# EAGLE design Platypus_v1_0_Proto_v16_0 (EAGLE 7.5.0)
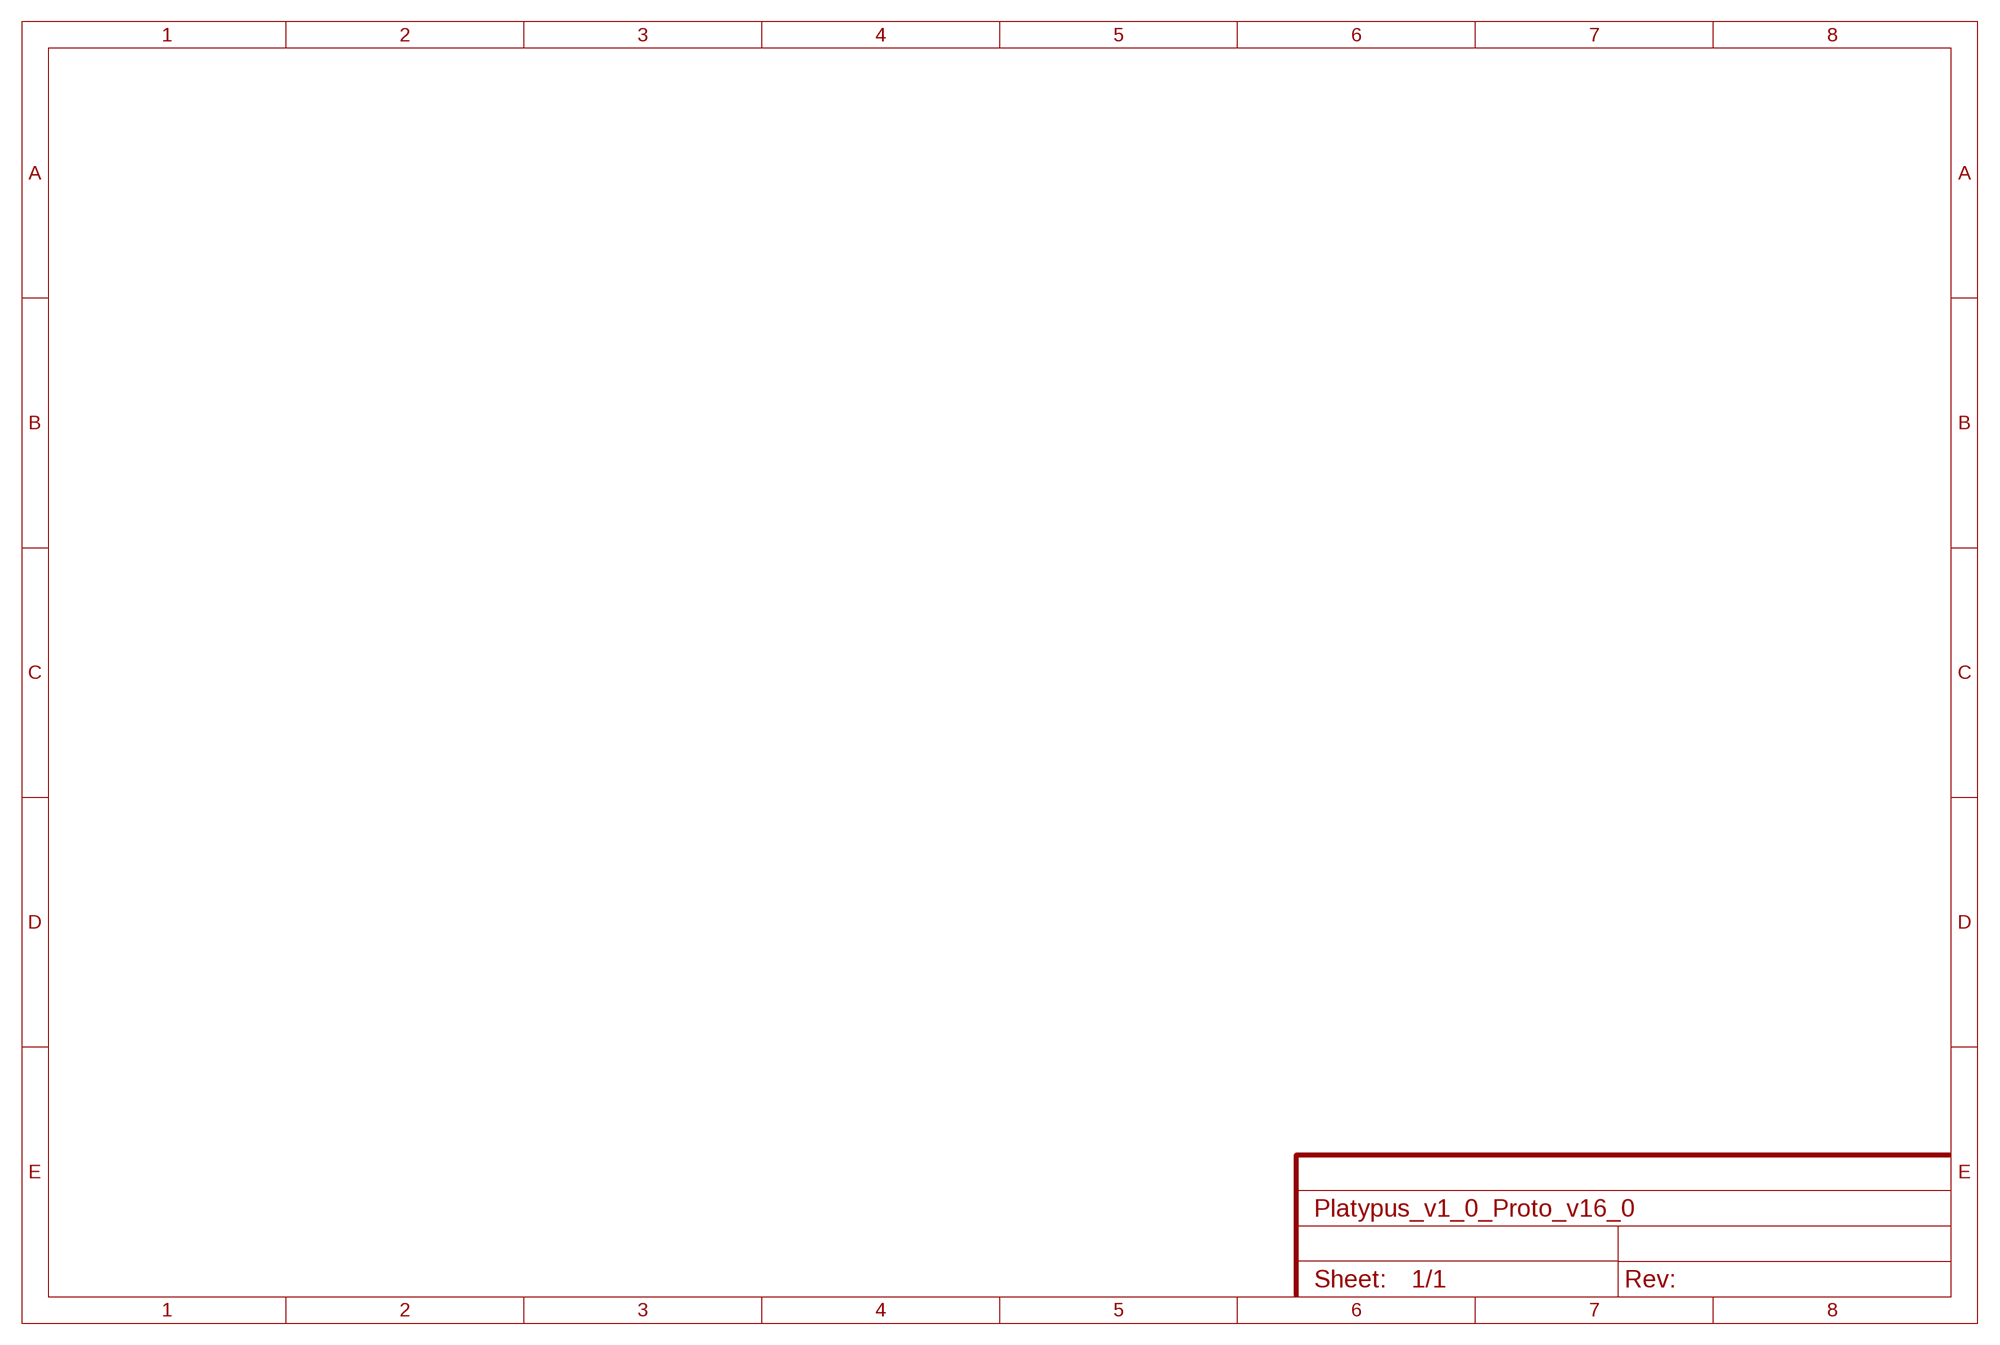
[diagram p0: schematic, sheet 1, part 1 of 2]
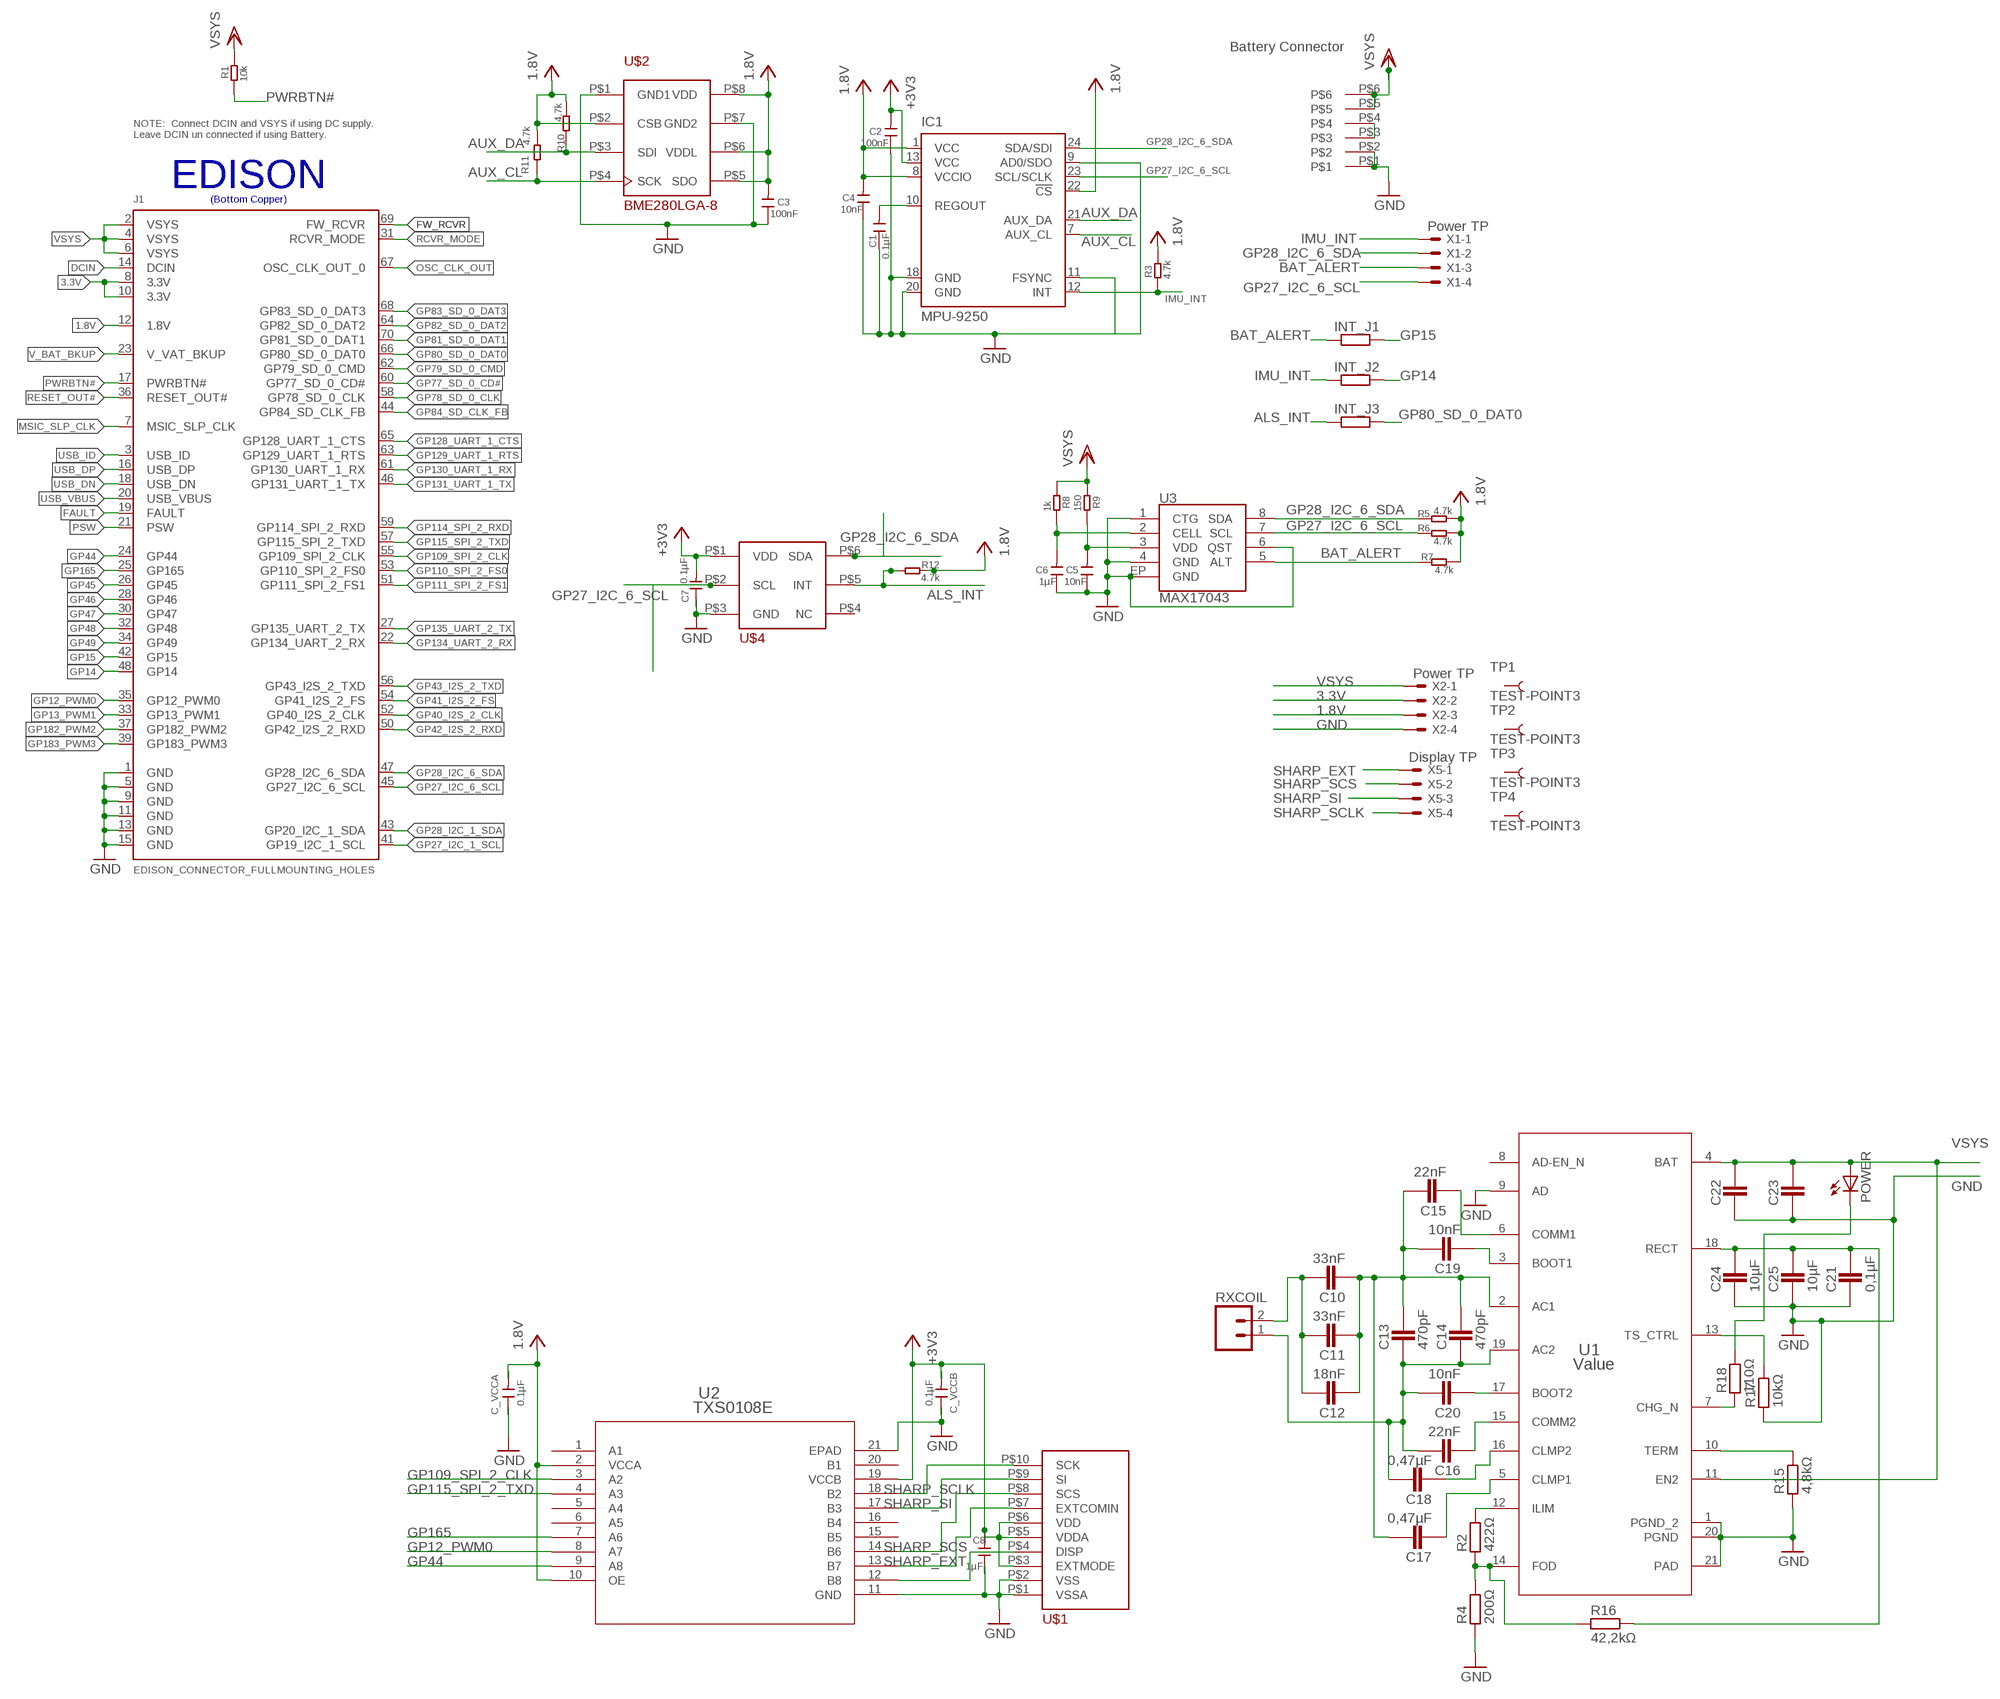
[diagram p1: schematic, sheet 1, part 2 of 2]

## Parts
C1  0.1µF  C-0603  [C0603]
C2  100nF  C-0603  [C0603]
C3  100nF  C-0603  [C0603]
C4  10nF  C-0603  [C0603]
C5  10nF  C-0603  [C0603]
C6  1µF  C-0603  [C0603]
C7  0.1µF  C-0603  [C0603]
C8  1µF  C-0603  [C0603]
C10  33nF  CAPACITOR_0402  [CAPC1005X60N]
C11  33nF  CAPACITOR_0402  [CAPC1005X60N]
C12  18nF  CAPACITOR_0402  [CAPC1005X60N]
C13  470pF  CAPACITOR_0402  [CAPC1005X60N]
C14  470pF  CAPACITOR_0402  [CAPC1005X60N]
C15  22nF  CAPACITOR_0402  [CAPC1005X60N]
C16  22nF  CAPACITOR_0402  [CAPC1005X60N]
C17  0,47µF  CAPACITOR_0402  [CAPC1005X60N]
C18  0,47µF  CAPACITOR_0402  [CAPC1005X60N]
C19  10nF  CAPACITOR_0402  [CAPC1005X60N]
C20  10nF  CAPACITOR_0402  [CAPC1005X60N]
C21  0,1µF  CAPACITOR_0402  [CAPC1005X60N]
C22  CAPACITOR_0402  [CAPC1005X60N]
C23  CAPACITOR_0402  [CAPC1005X60N]
C24  10µF  CAPACITOR_0603  [CAPC1608X92N]
C25  10µF  CAPACITOR_0603  [CAPC1608X92N]
C_VCCA  0.1µF  C-0603  [C0603]
C_VCCB  0.1µF  C-0603  [C0603]
IC1  MPU-9250  [QFN24-SMALL]
INT_J1  R-EU_R0201  [R0201]
INT_J2  R-EU_R0201  [R0201]
INT_J3  R-EU_R0201  [R0201]
J1  EDISON_CONNECTOR_FULLMOUNTING_HOLES  [EDISON_DAUGHTER]
POWER  LEDSML0603  [SML0603]
R1  10k  R-0603  [R0603]
R2  422Ω  RESISTOR_0402  [RESC1005X40AN]
R3  4.7k  R-0603  [R0603]
R4  200Ω  RESISTOR_0402  [RESC1005X40AN]
R5  4.7k  R-0603  [R0603]
R6  4.7k  R-0603  [R0603]
R7  4.7k  R-0603  [R0603]
R8  1k  R-0603  [R0603]
R9  150  R-0603  [R0603]
R10  4.7k  R-0603  [R0603]
R11  4.7k  R-0603  [R0603]
R12  4.7k  R-0603  [R0603]
R15  4,8kΩ  RESISTOR_0402  [RESC1005X40AN]
R16  42,2kΩ  RESISTOR_0402  [RESC1005X40AN]
R17  10kΩ  RESISTOR_0402  [RESC1005X40AN]
R18  110Ω  RESISTOR_0402  [RESC1005X40AN]
RXCOIL  M02LOCK  [1X02_LOCK]
TP1  TEST-POINT3  [PAD.03X.03]
TP2  TEST-POINT3  [PAD.03X.03]
TP3  TEST-POINT3  [PAD.03X.03]
TP4  TEST-POINT3  [PAD.03X.03]
U1  Value  BQ51050BRHLR  [RHL0020A]
U2  TXS0108E  TXS0108E_RGY_20  [RGY20_3P05X2P05]
U3  MAX17043  MAX1704X  [TDFN-8]
U$1  FH34SRJ-10S-0.5SH(50)FRC-10PIN-0.5MM  [FRC-10PIN-0.5MM]
U$2  BME280LGA-8  [LGA-8]
U$3  HIROSE_BAT_CON  [0.5MM-PITCH,6-PIN]
U$4  TSL25723FNFN-6PIN  [FN-6PIN]
X1  Power TP  53047-04  [53047-04]
X2  Power TP  53047-04  [53047-04]
X5  Display TP  53047-04  [53047-04]

## Nets
1.8V: C3.2 C4.2 C_VCCA.2 IC1.1(VCC) IC1.8(VCCIO) IC1.22(!CS) J1.12(1.8V) R3.2 R5.2 R6.2 R7.1 R10.2 R11.2 R12.2 U2.2(VCCA) U2.10(OE) U$2.P$2(CSB) U$2.P$5(SDO) U$2.P$6(VDDL) U$2.P$8(VDD) X2.3
3.3V: C2.2 C7.2 IC1.13(VCC) J1.8(3.3V) J1.10(3.3V) U$4.P$1(VDD) X2.2 ; supply symbol labelled +3V3
+3V3: C8.2 C_VCCB.2 U2.19(VCCB) U$1.P$3(EXTMODE) U$1.P$5(VDDA) U$1.P$6(VDD)
ALS_INT: INT_J3.1 R12.1 U$4.P$5(INT)
AUX_CL: IC1.7(AUX_CL) R11.1 U$2.P$4(SCK)
AUX_DA: IC1.21(AUX_DA) R10.1 U$2.P$3(SDI)
BAT_ALERT: INT_J1.1 R7.2 U3.5(ALT) X1.3
DCIN: J1.14(DCIN)
FAULT: J1.19(FAULT)
FW_RCVR: J1.69(FW_RCVR)
GND: C1.1 C2.1 C3.1 C4.1 C5.1 C6.1 C7.1 C21.1 C22.1 C23.1 C24.1 C25.1 C_VCCA.1 C_VCCB.1 IC1.9(AD0/SDO) IC1.11(FSYNC) IC1.18(GND) IC1.20(GND) J1.1(GND) J1.5(GND) J1.9(GND) J1.11(GND) J1.13(GND) J1.15(GND) R4.1 R15.1 R17.1 U1.1(PGND_2) U1.9(AD) U1.20(PGND) U1.21(PAD) U2.11(GND) U2.21(EPAD) U3.1(CTG) U3.4(GND) U3.6(QST) U3.EP(GND) U$1.P$1(VSSA) U$1.P$2(VSS) U$2.P$1(GND1) U$2.P$7(GND2) U$3.P$1 U$3.P$2 U$4.P$3(GND) X2.4
GP12_PWM0: J1.35(GP12_PWM0) U2.8(A7)
GP13_PWM1: J1.33(GP13_PWM1)
GP14: INT_J2.2 J1.48(GP14)
GP15: INT_J1.2 J1.42(GP15)
GP27_I2C_1_SCL: J1.41(GP19_I2C_1_SCL)
GP27_I2C_6_SCL: IC1.23(SCL/SCLK) J1.45(GP27_I2C_6_SCL) R6.1 U3.7(SCL) U$4.P$2(SCL) X1.4
GP28_I2C_1_SDA: J1.43(GP20_I2C_1_SDA)
GP28_I2C_6_SDA: IC1.24(SDA/SDI) J1.47(GP28_I2C_6_SDA) R5.1 U3.8(SDA) U$4.P$6(SDA) X1.2
GP40_I2S_2_CLK: J1.52(GP40_I2S_2_CLK)
GP41_I2S_2_FS: J1.54(GP41_I2S_2_FS)
GP42_I2S_2_RXD: J1.50(GP42_I2S_2_RXD)
GP43_I2S_2_TXD: J1.56(GP43_I2S_2_TXD)
GP44: J1.24(GP44) U2.9(A8)
GP45: J1.26(GP45)
GP46: J1.28(GP46)
GP47: J1.30(GP47)
GP48: J1.32(GP48)
GP49: J1.34(GP49)
GP77_SD_0_CD#: J1.60(GP77_SD_0_CD#)
GP78_SD_0_CLK: J1.58(GP78_SD_0_CLK)
GP79_SD_0_CMD: J1.62(GP79_SD_0_CMD)
GP80_SD_0_DAT0: INT_J3.2 J1.66(GP80_SD_0_DAT0)
GP81_SD_0_DAT1: J1.70(GP81_SD_0_DAT1)
GP82_SD_0_DAT2: J1.64(GP82_SD_0_DAT2)
GP83_SD_0_DAT3: J1.68(GP83_SD_0_DAT3)
GP84_SD_CLK_FB: J1.44(GP84_SD_CLK_FB)
GP109_SPI_2_CLK: J1.55(GP109_SPI_2_CLK) U2.3(A2)
GP110_SPI_2_FS0: J1.53(GP110_SPI_2_FS0)
GP111_SPI_2_FS1: J1.51(GP111_SPI_2_FS1)
GP114_SPI_2_RXD: J1.59(GP114_SPI_2_RXD)
GP115_SPI_2_TXD: J1.57(GP115_SPI_2_TXD) U2.4(A3)
GP128_UART_1_CTS: J1.65(GP128_UART_1_CTS)
GP129_UART_1_RTS: J1.63(GP129_UART_1_RTS)
GP130_UART_1_RX: J1.61(GP130_UART_1_RX)
GP131_UART_1_TX: J1.46(GP131_UART_1_TX)
GP134_UART_2_RX: J1.22(GP134_UART_2_RX)
GP135_UART_2_TX: J1.27(GP135_UART_2_TX)
GP165: J1.25(GP165) U2.7(A6)
GP182_PWM2: J1.37(GP182_PWM2)
GP183_PWM3: J1.39(GP183_PWM3)
IMU_INT: IC1.12(INT) INT_J2.1 R3.1 X1.1
MSIC_SLP_CLK: J1.7(MSIC_SLP_CLK)
N$2: U2.12(B8) U$1.P$4(DISP)
N$5: C1.2 IC1.10(REGOUT)
N$6: C6.2 R8.1 U3.2(CELL)
N$9: U$3.P$3 U$3.P$4
N$11: C10.2 C11.2 C12.2 RXCOIL.2
N$13: C5.2 R9.1 U3.3(VDD)
N$14: C10.1 C11.1 C12.1 C13.2 C14.2 C15.2 C17.2 C19.2 U1.2(AC1)
N$15: C13.1 C14.1 C16.2 C18.2 C20.2 RXCOIL.1 U1.19(AC2)
N$16: C15.1 U1.6(COMM1)
N$17: C16.1 U1.15(COMM2)
N$18: C17.1 U1.5(CLMP1)
N$19: C18.1 U1.16(CLMP2)
N$20: C19.1 U1.3(BOOT1)
N$21: C20.1 U1.17(BOOT2)
N$22: C21.2 C24.2 C25.2 R16.2 U1.18(RECT)
N$25: R2.2 U1.12(ILIM)
N$26: R2.1 R4.2 R16.1 U1.14(FOD)
N$27: R15.2 U1.10(TERM)
N$28: R17.2 U1.13(TS_CTRL)
N$29: POWER.C R18.2
N$30: R18.1 U1.7(CHG_N)
OSC_CLK_OUT: J1.67(OSC_CLK_OUT_0)
PSW: J1.21(PSW)
PWRBTN#: J1.17(PWRBTN#) R1.1
RCVR_MODE: J1.31(RCVR_MODE)
RESET_OUT#: J1.36(RESET_OUT#)
SHARP_EXT: U2.13(B7) U$1.P$7(EXTCOMIN) X5.1
SHARP_SCLK: U2.18(B2) U$1.P$10(SCK) X5.4
SHARP_SCS: U2.14(B6) U$1.P$8(SCS) X5.2
SHARP_SI: U2.17(B3) U$1.P$9(SI) X5.3
USB_DN: J1.18(USB_DN)
USB_DP: J1.16(USB_DP)
USB_ID: J1.3(USB_ID)
USB_VBUS: J1.20(USB_VBUS)
V_BAT_BKUP: J1.23(V_VAT_BKUP)
VSYS: C22.2 C23.2 J1.2(VSYS) J1.4(VSYS) J1.6(VSYS) POWER.A R1.2 R8.2 R9.2 U1.4(BAT) U1.11(EN2) U$3.P$5 U$3.P$6 X2.1
Unconnected: C8.1 TP1.P$1 TP2.P$1 TP3.P$1 TP4.P$1 U1.8(AD-EN_N) U2.1(A1) U2.5(A4) U2.6(A5) U2.15(B5) U2.16(B4) U2.20(B1) U$4.P$4(NC)

## Notes on the sheet
- Battery Connector
- NOTE:  Connect DCIN and VSYS if using DC supply.
  Leave DCIN un connected if using Battery.
- EDISON
- (Bottom Copper)

## Library data of the parts
C1-C8 C_VCCA C_VCCB = Discrete:C*: Ceramic Capacitors
C10-C25 = ipc-7351-capacitor:CAPACITOR_
IC1 = invensense:MPU-9250: 9-axis MotionTracking device communicate with I2C/SPI Source: http://www.invensense.com/mems/gyro/documents/PS-MPU-9250A-01.pdf
INT_J1-INT_J3 = resistor:R-EU_: RESISTOR, European symbol
J1 = Edison:EDISON_CONNECTOR_FULL
POWER = led:LED: LED OSRAM: - CHIPLED LG R971, LG N971, LY N971, LG Q971, LY Q971, LO R971, LY R971 LH N974, LH R974 LS Q976, LO Q976, LY Q976 LO Q996 - Hyper CHIPLED LW Q18S LB Q993, LB Q99A, LB R99A - SideLED LS A670, LO A670, LY A670, LG A670, LP A670 LB A673, LV A673, LT A673, LW A673 LH A674 LY A675 LS A676, LA A676, LO A676, LY A676, LW A676 LS A679, LY A679, LG A679 - Hyper Micro SIDELED® LS Y876, LA Y876, LO Y876, LY Y876 LT Y87S - SmartLED LW L88C, LW L88S LB L89C, LB L89S, LG L890 LS L89K, LO L89K, LY L89K LS L896, LA L896, LO L896, LY L896 - TOPLED LS T670, LO T670, LY T670, LG T670, LP T670 LSG T670, LSP T670, LSY T670, LOP T670, LYG T670 LG T671, LOG T671, LSG T671 LB T673, LV T673, LT T673, LW T673 LH T674 LS T676, LA T676, LO T676, LY T676, LB T676, LH T676, LSB T676, LW T676 LB T67C, LV T67C, LT T67C, LS T67K, LO T67K, LY T67K, LW E67C LS E67B, LA E67B, LO E67B, LY E67B, LB E67C, LV E67C, LT E67C LW T67C LS T679, LY T679, LG T679 LS T770, LO T770, LY T770, LG T770, LP T770 LB T773, LV T773, LT T773, LW T773 LH T774 LS E675, LA E675, LY E675, LS T675 LS T776, LA T776, LO T776, LY T776, LB T776 LHGB T686 LT T68C, LB T68C - Hyper Mini TOPLED® LB M676 - Mini TOPLED Santana® LG M470 LS M47K, LO M47K, LY M47K Source: http://www.osram.convergy.de LUXEON: - LUMILED® LXK2-PW12-R00, LXK2-PW12-S00, LXK2-PW14-U00, LXK2-PW14-V00 LXK2-PM12-R00, LXK2-PM12-S00, LXK2-PM14-U00 LXK2-PE12-Q00, LXK2-PE12-R00, LXK2-PE12-S00, LXK2-PE14-T00, LXK2-PE14-U00 LXK2-PB12-K00, LXK2-PB12-L00, LXK2-PB12-M00, LXK2-PB14-N00, LXK2-PB14-P00, LXK2-PB14-Q00 LXK2-PR12-L00, LXK2-PR12-M00, LXK2-PR14-Q00, LXK2-PR14-R00 LXK2-PD12-Q00, LXK2-PD12-R00, LXK2-PD12-S00 LXK2-PH12-R00, LXK2-PH12-S00 LXK2-PL12-P00, LXK2-PL12-Q00, LXK2-PL12-R00 Source: www.luxeon.com KINGBRIGHT: KA-3528ASYC Source: www.kingbright.com
R1 R3 R5-R12 = Discrete:R*
R2 R4 R15-R18 = ipc-7351-resistor:RESISTOR_
RXCOIL = SparkFun-Connectors:M02: Standard 2-pin 0.1" header. Use with - straight break away headers ( PRT-00116) - right angle break away headers (PRT-00553) - swiss pins (PRT-00743) - machine pins (PRT-00117) - female headers (PRT-00115) Molex polarized connector foot print use with: PRT-08233 with associated crimp pins and housings. 2.54_SCREWTERM for use with PRT-10571. 3.5mm Screw Terminal footprints for PRT-08084 5mm Screw Terminal footprints for use with PRT-08432
TP1-TP4 = SparkFun-Passives:TEST-POINT: Bare copper test points for troubleshooting or ICT
U1 = BQ51050:BQ51050BRHLR; COMPTYPE: IC; MANUFACTURER: Texas Instruments; MOUNTTYPE: SMT; PACKAGEREFERENCE: RHL0020A; PARTNUMBER: BQ51050BRHLR; PIN_COUNT: 21; REFDES: RefDes; ROHS: Y; TYPE: TYPE
U2 = TXS0108E_VQFN:TXS0108E_RGY_20; DATASHEETURL: http://www.ti.com/lit/gpn/TXS0108E; DESCRIPTION: 8-Bit Bidirectional Voltage-Level Translator For Open-Drain And Push-Pull Application; FAMILY_NAME: AUTO DIRECTION SENSING DUAL SUPPLY TRANSLATOR; GENERIC_PART_NUMBER: TXS0108E; INDUSTRY_STD_PKG_TYPE: VQFN; MANUFACTURER: Texas Instruments; MANUFACTURER_PART_NUMBER: txs0108e_rgy_20; PACKAGE_DESIGNATOR: RGY; PIN_COUNT: 20; VENDOR: Texas Instruments
U3 = SparkFun-PowerIC:MAX1704X: MAX17043/MAX17044: Battery Fuel Guage (43 is 1cell, 44 is 2cell); PROD-ID: IC-10399
U$1 = SHARP_DISP_CON:FH34SRJ-10S-0.5SH(50)
U$2 = BME280:BME280
U$3 = Hirose_Bat_Con:HIROSE_BAT_CON
U$4 = TSL25723FN:TSL25723FN
X1 X2 X5 = con-molex:53?-04: CONNECTOR wire to board 1.25 mm (.049 inch) pitch header; MF: WALDOM/MOLEX; MPN: 53047-0410; OC_FARNELL: 9733060; OC_NEWARK: 38C9900

## Board
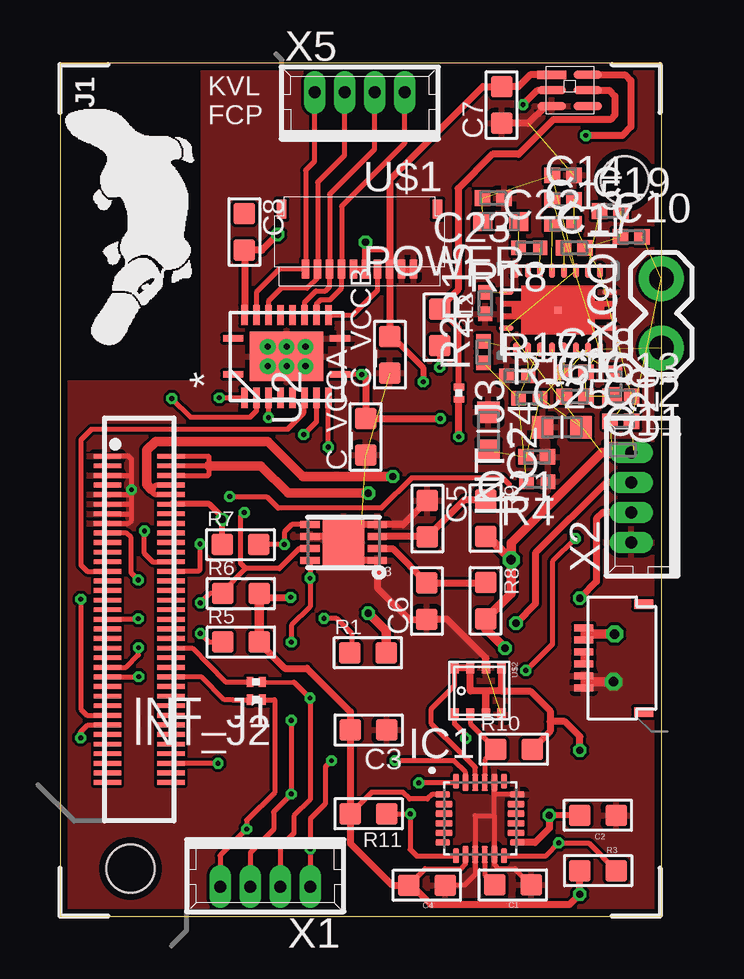
[diagram p2: board, top side]
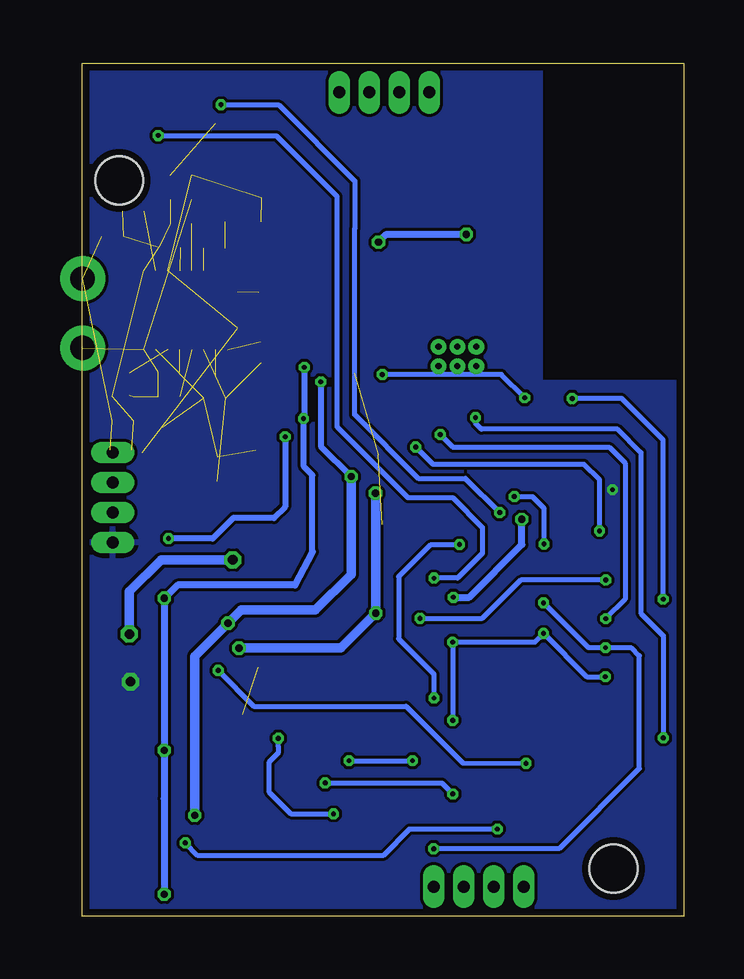
[diagram p3: board, bottom side, seen from below]

Size 25.07 x 35.55 mm. Coordinates in mm from the lower left corner, seen from the top.
Outline: 0,0 25.07,0 25.07,35.55 0,35.55 0,0
Copper layers (1*16): Top 0.035mm / dielectric 1.5mm / Bottom 0.035mm
Design rules "PCB-POOL HighSpec": minimum track width 0.125mm, minimum drill 0.2mm, track to track 0.125mm, track to pad 0.125mm, pad to pad 0.125mm, via to via 0.125mm, smd to smd 0.125mm, copper to edge 0.3mm, drill to drill 0.2mm, minimum pad ring 0.2mm, minimum via ring 0.125mm, stop-mask expansion 0.075mm, vias tented up to drill 0mil, thermal gap 0.2mm

### Footprints (pad centres in the part's own frame; a part is rotated, then mirrored left to right if it is on the bottom)
C0603 = smd 0.889 x 0.889: 1 -0.762,0; 2 0.762,0
CAPC1005X60N = smd 0.65 x 0.65: 1 -0.45,0; 2 0.45,0
CAPC1608X92N = smd 0.9 x 0.95: 1 -0.8,0; 2 0.8,0
QFN24-SMALL = smd 0.6 x 0.25: 1 -1.55,1; 6 -1.55,-1; 13 1.55,-1; 18 1.55,1 | smd 0.7 x 0.25: 2 -1.5,0.6; 3 -1.5,0.2; 4 -1.5,-0.2; 5 -1.5,-0.6; 14 1.5,-0.6; 15 1.5,-0.2; 16 1.5,0.2; 17 1.5,0.6 | smd 0.25 x 0.6: 7 -1,-1.55; 12 1,-1.55; 19 1,1.55; 24 -1,1.55 | smd 0.25 x 0.7: 8 -0.6,-1.5; 9 -0.2,-1.5; 10 0.2,-1.5; 11 0.6,-1.5; 20 0.6,1.5; 21 0.2,1.5; 22 -0.2,1.5; 23 -0.6,1.5
R0201 = smd 0.28 x 0.43: 1 -0.255,0; 2 0.255,0
EDISON_DAUGHTER = smd 1.14 x 0.2: 1 1.98,19.17; 2 4.62,19.17; 3 1.98,18.77; 4 4.62,18.77; 5 1.98,18.37; 6 4.62,18.37; 7 1.98,17.97; 8 4.62,17.97; 9 1.98,17.57; 10 4.62,17.57; 11 1.98,17.17; 12 4.62,17.17; 13 1.98,16.77; 14 4.62,16.77; 15 1.98,16.37; 16 4.62,16.37; 17 1.98,15.97; 18 4.62,15.97; 19 1.98,15.57; 20 4.62,15.57; 21 1.98,15.17; 22 4.62,15.17; 23 1.98,14.77; 24 4.62,14.77; 25 1.98,14.37; 26 4.62,14.37; 27 1.98,13.97; 28 4.62,13.97; 29 1.98,13.57; 30 4.62,13.57; 31 1.98,13.17; 32 4.62,13.17; 33 1.98,12.77; 34 4.62,12.77; 35 1.98,12.37; 36 4.62,12.37; 37 1.98,11.97; 38 4.62,11.97; 39 1.98,11.57; 40 4.62,11.57; 41 1.98,11.17; 42 4.62,11.17; 43 1.98,10.77; 44 4.62,10.77; 45 1.98,10.37; 46 4.62,10.37; 47 1.98,9.97; 48 4.62,9.97; 49 1.98,9.57; 50 4.62,9.57; 51 1.98,9.17; 52 4.62,9.17; 53 1.98,8.77; 54 4.62,8.77; 55 1.98,8.37; 56 4.62,8.37; 57 1.98,7.97; 58 4.62,7.97; 59 1.98,7.57; 60 4.62,7.57; 61 1.98,7.17; 62 4.62,7.17; 63 1.98,6.77; 64 4.62,6.77; 65 1.98,6.37; 66 4.62,6.37; 67 1.98,5.97; 68 4.62,5.97; 69 1.98,5.57; 70 4.62,5.57 | hole 2: 23.53,30.67; 2.93,1.98
SML0603 = smd 0.8 x 0.8: A 0.75,0; C -0.75,0
R0603 = smd 0.889 x 0.889: 1 -0.762,0; 2 0.762,0
RESC1005X40AN = smd 0.6 x 0.6: 1 -0.45,0; 2 0.45,0
1X02_LOCK = drill 1.016 pad 1.88: 1 -0.178,0; 2 2.718,0
PAD.03X.03 = smd 0.762 x 0.762: P$1 0,0
RHL0020A = smd 0.229 x 0.61: 1 -0.75,2.15; 10 -0.75,-2.15; 11 0.75,-2.15; 20 0.75,2.15 | smd 0.61 x 0.229: 2 -1.65,1.75; 3 -1.65,1.25; 4 -1.65,0.75; 5 -1.65,0.25; 6 -1.65,-0.25; 7 -1.65,-0.75; 8 -1.65,-1.25; 9 -1.65,-1.75; 12 1.65,-1.75; 13 1.65,-1.25; 14 1.65,-0.75; 15 1.65,-0.25; 16 1.65,0.25; 17 1.65,0.75; 18 1.65,1.25; 19 1.65,1.75 | smd 0.305 x 0.305: 21 0,0
RGY20_3P05X2P05 = smd 0.279 x 0.838: 1 -0.75,2.225; 10 -0.75,-2.225; 11 0.75,-2.225; 20 0.75,2.225 | smd 0.838 x 0.279: 2 -1.725,1.75; 3 -1.725,1.25; 4 -1.725,0.75; 5 -1.725,0.25; 6 -1.725,-0.25; 7 -1.725,-0.75; 8 -1.725,-1.25; 9 -1.725,-1.75; 12 1.725,-1.75; 13 1.725,-1.25; 14 1.725,-0.75; 15 1.725,-0.25; 16 1.725,0.25; 17 1.725,0.75; 18 1.725,1.25; 19 1.725,1.75 | smd 2.057 x 3.048: 21 0,0 | drill 0.254: V -0.406,-0.787; V_1 -0.406,0; V_2 -0.406,0.787; V_3 0.406,-0.787; V_4 0.406,0; V_5 0.406,0.787
TDFN-8 = smd 0.8 x 0.3: 1 -1.4,0.75; 2 -1.4,0.25; 3 -1.4,-0.25; 4 -1.4,-0.75; 5 1.4,-0.75; 6 1.4,-0.25; 7 1.4,0.25; 8 1.4,0.75 | smd 1.73 x 1.88: EP 0,0
FRC-10PIN-0.5MM = smd 0.3 x 0.8: P$1 0,0; P$2 0.5,0; P$3 1,0; P$4 1.5,0; P$5 2,0; P$6 2.5,0; P$7 3,0; P$8 3.5,0; P$9 4,0; P$10 4.5,0 | smd 0.4 x 0.8: P$11 -1,-2.5; P$12 5.5,-2.5
LGA-8 = smd 0.5 x 0.35: P$1 0.975,0.975; P$2 0.975,0.325; P$3 0.975,-0.325; P$4 0.975,-0.975; P$5 -0.975,-0.975; P$6 -0.975,-0.325; P$7 -0.975,0.325; P$8 -0.975,0.975
0.5MM-PITCH,6-PIN = smd 0.3 x 0.8: P$1 0,0; P$2 0.5,0; P$3 1,0; P$4 1.5,0; P$5 2,0; P$6 2.5,0 | smd 0.4 x 0.8: P$7 -1,-2.5; P$8 3.5,-2.5
FN-6PIN = smd 1.2 x 0.35: P$1 0,0; P$2 0,-0.65; P$3 0,-1.3; P$4 1.5,-1.3; P$5 1.5,-0.65; P$6 1.5,0
53047-04 = drill 0.5 pad 0.698 long: 1 1.875,0.45; 2 0.625,0.45; 3 -0.625,0.45; 4 -1.875,0.45

### Placement (x,y rotation side)
C1  18.87,1.3 180 top
C2  22.41,4.21 180 top
C3  12.86,7.76 180 top
C4  15.29,1.29 180 top
C5  15.31,16.57 270 top
C6  15.29,13.13 90 top
C7  18.4,33.81 90 top
C8  7.68,28.52 270 top
C10  23.8,28.32 0 top
C11  23.45,19.43 0 top
C12  23.37,20.63 0 top
C13  23.37,21.66 0 top
C14  20.96,29.86 0 top
C15  20.96,28.86 0 top
C16  21.46,21.66 0 top
C17  21.43,27.86 0 top
C18  21.46,22.67 0 top
C19  22.93,29.39 0 top
C20  23.11,22.18 270 top
C21  19.87,19.14 180 top
C22  20.96,30.88 180 top
C23  18.05,29.93 180 top
C24  17.85,20.21 270 top
C25  20.91,20.38 0 top
C_VCCA  12.73,19.98 90 top
C_VCCB  13.74,23.4 90 top
IC1  17.5,4.07 0 top
INT_J1  8.17,9.76 180 top
INT_J2  8.17,9.02 180 top
INT_J3  16.62,21.8 270 top
J1  0,0 0 top
POWER  18.37,28.95 180 top
R1  12.83,10.98 0 top
R2  17.64,23.51 90 top
R3  22.42,1.89 180 top
R4  19.89,18.11 180 top
R5  7.54,11.42 0 top
R6  7.54,13.45 0 top
R7  7.52,15.49 0 top
R8  17.73,13.14 270 top
R9  17.73,16.59 270 top
R10  18.91,6.96 0 top
R11  12.86,4.27 180 top
R12  15.82,24.55 270 top
R15  17.72,25.55 90 top
R16  19.55,21.59 0 top
R17  19.06,22.52 0 top
R18  19.56,27.85 180 top
RXCOIL  25.06,23.86 90 top
TP1  -3.12,-5.59 0 top  (outside the outline)
TP2  -3.68,-7.07 0 top  (outside the outline)
TP3  -4.24,-8.55 0 top  (outside the outline)
TP4  -4.8,-10.03 0 top  (outside the outline)
U1  20.75,25.26 270 top
U2  9.44,23.33 90 top
U3  11.82,15.57 180 top
U$1  14.73,26.97 180 top
U$2  17.42,9.39 270 top
U$3  21.82,9.51 90 top
U$4  20.49,35.07 0 top
X1  8.55,1.68 180 top
X2  24.25,17.46 90 top
X5  12.49,33.89 0 top

### Tracks (layer width: path | path; a pad name or v marks a point on that pad's centre or on a via)
1.8V  (via drill 0.2, 0.3)
  Top 0.2: C4.2 15.22,1.98 16.71,1.98 16.9,2.17 IC1.8 | IC1.22 17.31,6.19 16.68,6.82 15.47,8.02 15.47,8.64 16.44,9.61 U$2.P$5 | IC1.1 15.5,5.07 15.31,4.88 14.57,4.88 14.29,5.16 12.99,5.16 R11.2 | U2.2 | v12.57,22.58 U2.10 | U2.10 | v6.64,21.61 U2.2
  Top 0.24: 6.22,17.17 J1.12
  Top 0.25: R7.1 6.76,16.63
  Top 0.254: 6.22,17.17 6.76,16.63 v6.76,16.54 | R12.2 v15.82,22.88
  Top 0.3: R3.2 v21.66,0.91 v21.65,0.91 21.23,0.49 15.44,0.49 14.59,1.34 C4.2 13.85,1.29 12.1,3.04 R11.2 C3.2 12.1,8.52 10.29,10.33 9.36,10.33 8.3,11.39 8.29,11.39 8.29,13.29 8.31,13.29 | 6.76,16.63 v6.76,16.54 | R6.2 8.31,13.29 | 8.3,11.37 R5.2 | 18.41,10.37 U$2.P$8 18.39,9.38 | U$2.P$5 U$2.P$6 17.1,9.38 17.74,9.38 | 8.3,11.41 R5.2 | 8.3,11.4 R5.2 | 8.31,13.29 v9.61,13.29 | R10.2 20.42,7.71 20.42,8.11 | 17.75,9.38 17.74,9.38 | 18.39,9.38 17.75,9.38 | 17.75,9.38 U$2.P$2 17.74,9.38 | 18.39,9.38 19.58,9.38 20.42,8.55 20.42,8.11 | v21.66,6.91 21.66,7.49 21.04,8.11 20.42,8.11 | X2.3 22.61,16.84 22.35,16.57 22.35,13.95 v21.65,13.25 | v12.57,22.58 12.73,22.42 C_VCCA.2 v15.85,20.74
  Top 0.4: R6.2 R5.2 | R7.1
  Bottom 0.2: v12.57,22.58 7.61,22.58 v6.64,21.61
  Bottom 0.254: 15.48,15.18 15.48,18.38 15.84,18.74 v15.84,20.73 v15.85,20.74 15.82,20.77 v15.82,22.88
  Bottom 0.3: v21.66,0.91 21.66,4.89 v21.66,6.91 v21.65,13.25 21.1,13.8 16.21,13.8 15.48,15.18 | v9.61,13.29 8.96,13.29 R7.1 6.76,16.63 v6.76,16.54
3.3V  (via drill 0.2, 0.3)
  Top 0.2: J1.10 4.03,17.57 arc-90 3.81,17.79 3.99,17.97 J1.8
  Top 0.25: C2.2 21.64,4.2 v20.39,4.2
  Top 0.254: 13.74,27.02 13.74,26.55 | 13.74,24.26 15.13,22.87 v15.13,22.27
  Top 0.3: v20.39,4.2 20.39,3.66 19.8,3.07 IC1.13 | U$4.P$1 19.59,35.07 19.09,34.57 C7.2 17.62,34.58 13.74,30.7 13.74,26.55 13.74,24.26 | X2.2 22.77,18.09 19.81,15.13 19.81,13.02 v19,12.21 | v13.88,18.32 v13.87,18.32
  Top 0.4: 13.87,18.34 v13.87,18.32 10.12,18.32 8.65,19.79 3.98,19.79 3.61,19.42 3.61,17.99 3.81,17.79
  Bottom 0.254: 18.98,12.2 v18.99,12.2 v19,12.21 | v15.13,22.27 15.13,19.58 v13.87,18.32
  Bottom 0.4: v20.39,4.2 20.39,10.82 v19,12.21 18.45,12.76 15.36,12.76 13.87,14.25 v13.87,18.32
+3V3  (via drill 0.3)
  Top 0.2: 12.73,27.77 12.73,27.79 13.73,27.79 U$1.P$3
  Top 0.3: U$1.P$6 U$1.P$5 12.73,27.77 v12.73,28.09 | v9.07,28.42 8.41,27.76 C8.2 7.69,27.75 U2.19 | U$1.P$3 C_VCCB.2
  Bottom 0.3: v12.73,28.09 12.4,28.42 v9.07,28.42
ALS_INT
  Top 0.254: INT_J3.1 16.62,24.51 R12.1
  Top 0.3: U$4.P$5 22.89,34.42 23.12,34.19 23.12,33.39 22.94,33.21 20.56,33.21 19.11,31.76 18.02,31.76 16.59,30.33 16.59,26.12 15.82,25.35 R12.1
AUX_CL  (via drill 0.2)
  Top 0.2: IC1.7 14.86,2.51 14.59,2.78 v14.6,4.26 R11.1 | v16.9,7.41 16.9,7.55 16.44,8.01 U$2.P$4
  Bottom 0.2: v16.9,7.41 16.91,7.09 16.91,6.8 17.3,6.4 17.3,5.19 16.38,4.27 v14.6,4.26
AUX_DA
  Top 0.2: U$2.P$3 17.09,8.01 R10.1 17.7,6.51 IC1.21
BAT_ALERT  (via drill 0.2)
  Top 0.2: R7.2 v9.35,15.49 9.35,16.01 9.66,16.32 U3.5 | INT_J1.1 9.76,9.75 v10.42,9.08 | v10.42,9.09 v10.42,9.08 | v10.42,9.08 10.42,4.85 9.74,4.17 9.74,3.46 9.17,2.89 9.17,1.16 X1.3
  Bottom 0.2: v9.35,15.49 10.55,15.49 11.89,14.15 11.89,11.56 10.42,10.09 v10.42,9.09
GND  (via drill 0.2, 0.4)  (4 unrouted)
  Top 0.2: C4.1 16.85,1.29 17.3,1.74 IC1.9 17.3,4.18 18.1,4.18 | C1.1 18.95,1.98 18.27,1.98 18.1,2.15 IC1.11 18.1,4.18 | 18.1,4.18 18.1,5.06 | 18.1,5.06 IC1.20 | IC1.18 18.11,5.07 18.1,5.06 | J1.15 2.85,16.37 2.98,16.5 2.98,16.77 | 2.98,17.13 2.98,17.54 | 2.98,17.54 v2.98,17.77 2.98,18.38 | 2.98,18.38 2.98,19.04 2.85,19.17 J1.1 | J1.5 2.97,18.37 2.98,18.38 | J1.9 2.95,17.57 2.98,17.54 | J1.11 2.94,17.17 2.98,17.13 | J1.13 2.98,16.77 | 2.98,16.77 2.98,17.13
  Top 0.3: 12.57,16.32 U3.4 14.3,16.32 C5.1 | 12.26,14.82 U3.1 13.22,13.68 14.55,12.36 C6.1 | 11.57,15.82 U3.6 | U$2.P$7 17.75,10.75 16.13,12.37 C6.1 | U$3.P$2 U$3.P$1 21.9,9.77 | U$4.P$3 20.23,33.77 19.51,33.05 C7.1 | U$1.P$1 | U$1.P$2 U$1.P$1 | U$1.P$1
  Top 0.4: 21.9,9.77 v23.06,9.77
  Top 0.406: 12.57,16.32 arc90 U3.EP | 12.26,14.82 arc-90 12.21,14.87 12.21,15.18 arc90 U3.EP | U3.EP 11.57,15.82 | C6.1
  pour Bottom: 5.99,35.44 24.97,35.44 24.97,0.14 0.1,0.14 0.1,22.25 5.97,22.25 5.97,35.43
  pour Top: 7.85,35.44 24.97,35.44 24.97,0.99 24.97,0.14 0.94,0.14 0.1,0.14 0.1,21.45 0.1,22.25 3.81,22.25 5.97,22.25 5.97,34.28 5.97,35.44 7.65,35.44
GP12_PWM0  (via drill 0.2)
  Top 0.2: J1.35 3.23,12.37 v3.26,12.4 | v10.15,20.07 10.69,20.61 U2.8
  Bottom 0.2: v3.26,12.4 2.45,13.21 2.45,18.88 3.12,19.55 9.63,19.55 v10.15,20.07
GP14
  Top 0.2: J1.48 5.9,9.97 6.85,9.02 7.18,9.02 7.17,9.02 INT_J2.2
GP15
  Top 0.2: INT_J1.2 6.89,9.77 5.51,11.17 J1.42
GP27_I2C_6_SCL  (via drill 0.2)
  Top 0.2: 3.27,11.04 v3.27,11.19 3.27,10.88 2.76,10.37 J1.45 | U3.7 9.97,15.32 9.14,14.49 7.75,14.49 | 7.75,14.49 6.78,13.52 R6.1 6.24,13.45 v5.85,13.06 | X1.4 10.43,1.16 v10.43,2.81 10.43,4.05 11.06,4.68 11.06,6.23 v11.31,6.48 | IC1.23 16.9,5.99 16.41,6.48 v13.96,6.48 | 7.75,14.49 7.53,14.71 7.53,16.67 v7.68,16.82
  Top 0.3: U$4.P$2 19.87,34.4 v19.29,33.82
  Bottom 0.2: v10.43,2.81 5.2,2.81 1.86,6.15 1.86,10.85 2.18,11.17 3.25,11.17 v3.27,11.19 3.98,11.19 v5.85,13.06 | v13.96,6.48 v11.31,6.48 | v7.68,16.82 9.11,18.25 11.07,18.25 13.72,20.9 13.72,28.65 13.71,28.66 13.71,30.64 16.89,33.82 v19.29,33.82
GP28_I2C_6_SDA  (via drill 0.2)
  Top 0.2: v5.85,11.78 6.21,11.42 R5.1 | U3.8 v10.42,14.09 10.42,12.89 9.64,12.11 v9.64,11.42 | X1.2 7.93,1.16 7.93,2.64 8.9,3.61 8.9,4.34 v9.64,5.08 | IC1.24 16.43,5.55 v14.95,5.55 | v9.64,8.16 v9.64,5.08 | v9.63,5.09 v9.64,5.08 | J1.47 3.3,9.97 v3.28,9.98
  Top 0.3: U$4.P$6 23.55,35.07 23.79,34.83 23.79,32.9 23.43,32.54 v21.91,32.54
  Bottom 0.2: v9.64,8.16 v9.64,11.42 6.21,11.42 v5.85,11.78 4.05,9.98 v3.28,9.98 | v10.42,14.09 9.43,14.09 8.4,15.12 8.4,16.21 9.63,17.44 11.5,17.44 14.45,20.39 14.45,28.1 14.46,28.11 14.46,30.01 16.98,32.53 v21.92,32.53 v21.91,32.54 | v14.95,5.55 10.09,5.55 v9.63,5.09
GP44  (via drill 0.2)
  Top 0.2: J1.24 3.86,14.77 3.52,15.11 v3.52,16.06 | U2.9 11.18,21.59 v11.18,19.55
  Bottom 0.2: v3.52,16.06 3.52,18.18 4.17,18.83 10.45,18.83 v11.17,19.55 v11.18,19.55
GP45  (via drill 0.2)
  Top 0.2: 18.72,18 18.45,18.27 14.65,18.27 13.39,17.01 9.09,17.01 8.61,17.49 v7.07,17.49 | v5.83,15.51 5.83,14.43 5.78,14.37 J1.26
  Bottom 0.2: v5.83,15.51 5.83,17 6.31,17.48 v7.06,17.48 v7.07,17.49
GP80_SD_0_DAT0  (via drill 0.2)
  Top 0.2: v6.58,6.37 J1.66 | v21.48,15.74 20.52,14.78 20.52,11.33 19.43,10.24 v19.41,10.24
  Top 0.3: v16.62,19.98 INT_J3.2
  Bottom 0.2: v6.58,6.37 9.21,6.38 11.58,8.75 17.92,8.75 v19.41,10.24
  Bottom 0.254: v21.48,15.74 19.64,15.74 18.78,16.6 18.77,16.59 17.09,16.59 16.62,17.06 v16.62,19.98
GP109_SPI_2_CLK  (via drill 0.2)
  Top 0.2: v0.87,13.21 0.87,8.62 1.12,8.37 J1.55 | 8.2,21.59 U2.3 8.19,21.07 7.92,20.8 5.44,20.8 v4.66,21.58
  Bottom 0.2: 0.87,13.15 v0.87,13.21 0.87,19.85 2.6,21.58 v4.66,21.58
GP115_SPI_2_TXD  (via drill 0.2)
  Top 0.2: v0.86,7.43 0.86,7.67 1.16,7.97 J1.57 | v8.69,20.78 U2.4 | U2.4
  Bottom 0.2: v0.86,7.43 0.86,11.68 1.8,12.62 1.8,19.33 2.77,20.3 8.44,20.3 8.44,20.31 8.69,20.56 v8.69,20.78
GP165
  Top 0.2: J1.25 1.13,14.37 0.87,14.63 0.87,19.85 1.32,20.3 9.45,20.3 9.46,20.29 10.17,21 10.17,21.59 U2.7
IMU_INT  (via drill 0.2)
  Top 0.2: INT_J2.1 8.94,9.02 8.94,5.14 7.78,4 v7.78,3.63 6.67,2.53 X1.1 | R3.1 22.02,3.05 v20.78,3.05 20.25,2.52 IC1.12
  Bottom 0.2: v7.78,3.63 11.43,3.63 12.54,2.52 20.25,2.52 v20.78,3.05
N$2
  Top 0.2: U2.12 12.19,25.05 13.23,26.09 U$1.P$4
N$5
  Top 0.2: IC1.10 17.7,1.71 C1.2
N$6
  Top 0.3: 17.68,13.89 C6.2 13.86,15.32 U3.2
  Top 0.406: 17.68,13.89 R8.1
N$9
  Top 0.3: U$3.P$4 U$3.P$3
N$11  (3 unrouted)
N$13
  Top 0.3: 15.3,15.82 U3.3 | R9.1 16.85,17.35 C5.2
  Top 0.406: C5.2 15.3,15.82
N$14  (8 unrouted)
N$15  (6 unrouted)
N$16  (1 unrouted)
N$17  (1 unrouted)
N$18  (1 unrouted)
N$19  (1 unrouted)
N$20  (1 unrouted)
N$21  (1 unrouted)
N$22  (4 unrouted)
N$25  (1 unrouted)
N$26  (3 unrouted)
N$27  (1 unrouted)
N$28  (1 unrouted)
N$29  (1 unrouted)
N$30  (1 unrouted)
PWRBTN#  (via drill 0.2)
  Top 0.2: R1.1 12.17,11.24 12.17,11.76 11.53,12.4 v11.01,12.4 v11,12.41 | J1.17 2.77,15.97 2.96,15.78 2.96,14.31 v3.26,14.01
  Bottom 0.2: v11,12.41 8.4,12.41 6.8,14.01 v3.26,14.01
SHARP_EXT
  Top 0.2: X5.1 14.37,32.23 11.73,29.59 U$1.P$7 11.73,26.18 11.25,25.7 10.86,25.7 10.69,25.53 U2.13
SHARP_SCLK
  Top 0.2: X5.4 10.61,34.4 10.61,31.47 10.23,31.09 U$1.P$10 9.14,26.97 8.18,26.01 8.18,25.06 U2.18
SHARP_SCS
  Top 0.2: X5.2 13.11,31.97 11.23,30.09 U$1.P$8 11.23,26.24 11.05,26.06 10.66,26.06 10.19,25.59 U2.14
SHARP_SI
  Top 0.2: X5.3 11.86,31.72 10.73,30.59 U$1.P$9 10.73,26.6 10.3,26.17 9.22,26.17 8.68,25.63 8.68,25.06 U2.17
VSYS  (via drill 0.3, 0.4)  (5 unrouted)
  Top 0.2: 6.21,18.77 J1.4 | J1.2 6.19,19.17 6.19,18.79 6.19,18.37 J1.6
  Top 0.3: U$3.P$6 U$3.P$5 21.9,11.76
  Top 0.4: v18.54,11.17 17.73,11.98 R8.2 18.8,13.45 v18.8,14.85 | R1.2 13.59,11.88 v12.84,12.63 | R9.2 17.82,15.83 v18.8,14.85 | v23.11,11.76 21.9,11.76 | 18.8,14.96 v18.8,14.85 | 18.8,15.31 v18.8,14.85 | v18.8,14.85 18.8,15.56 22.58,19.34 X2.1 | 6.19,18.79 6.21,18.77 8.36,18.77 9.5,17.63 v12.85,17.63
  Top 0.406: R8.2
  Bottom 0.4: v18.54,11.17 14.3,11.17 v12.84,12.63 v12.84,17.63 v12.85,17.63 | v18.8,14.85 21.79,14.85 23.11,13.53 v23.11,11.76

### Text on the board
tDocu: Display Test Point | TSL25723FN | SHARP_SCK | SHARP_SI | SHARP_SCS | SHARP_EXT | Ambient Light Sensor(ALS) | C7 0.1µF | SHARP / Display / Connector | Antenna KOZ | TXS0108E | Level / / Shifter | R12 4k7 | MCP73832 / Battery Charger | J_ALS | Power TP | VSYS | 3V3 | C_VCCB / 0.1µF | C_VCCA / 0.1µF | C8 1µF | 1V8 | R7 4k7 | MAX / 17043 | C5 10nF | R9 150 | GND | R6 4k7 | Battery / Gauge | C6 1µF | R5 4k7 | R8 1k | VSYS | R1 10k | TEMP | J_IMU | J_BAT | GND | Pressure / Humidity / Temperature / Sensor | BME / 280 | C3 0.1µF | R10 4k7 | Power / Connector | Intel Edison 70-pin Hirose Connector | R11 4k7 | MPU / 9255 | C2 0.1µF | 9DOF / IMU | C4 10nF | C1 0.1µF | R3 4k7 | IMU_INT | I2C_1_SDA | BAT_INT | I2C_1_SCL | I2C Test Point
tSilk: KVL / FCP | Platypus v2.0
_tsilk: Prototype v1.0